# EAGLE design Quad VCA (no pots) CTRL v1 (EAGLE 7.7.0)
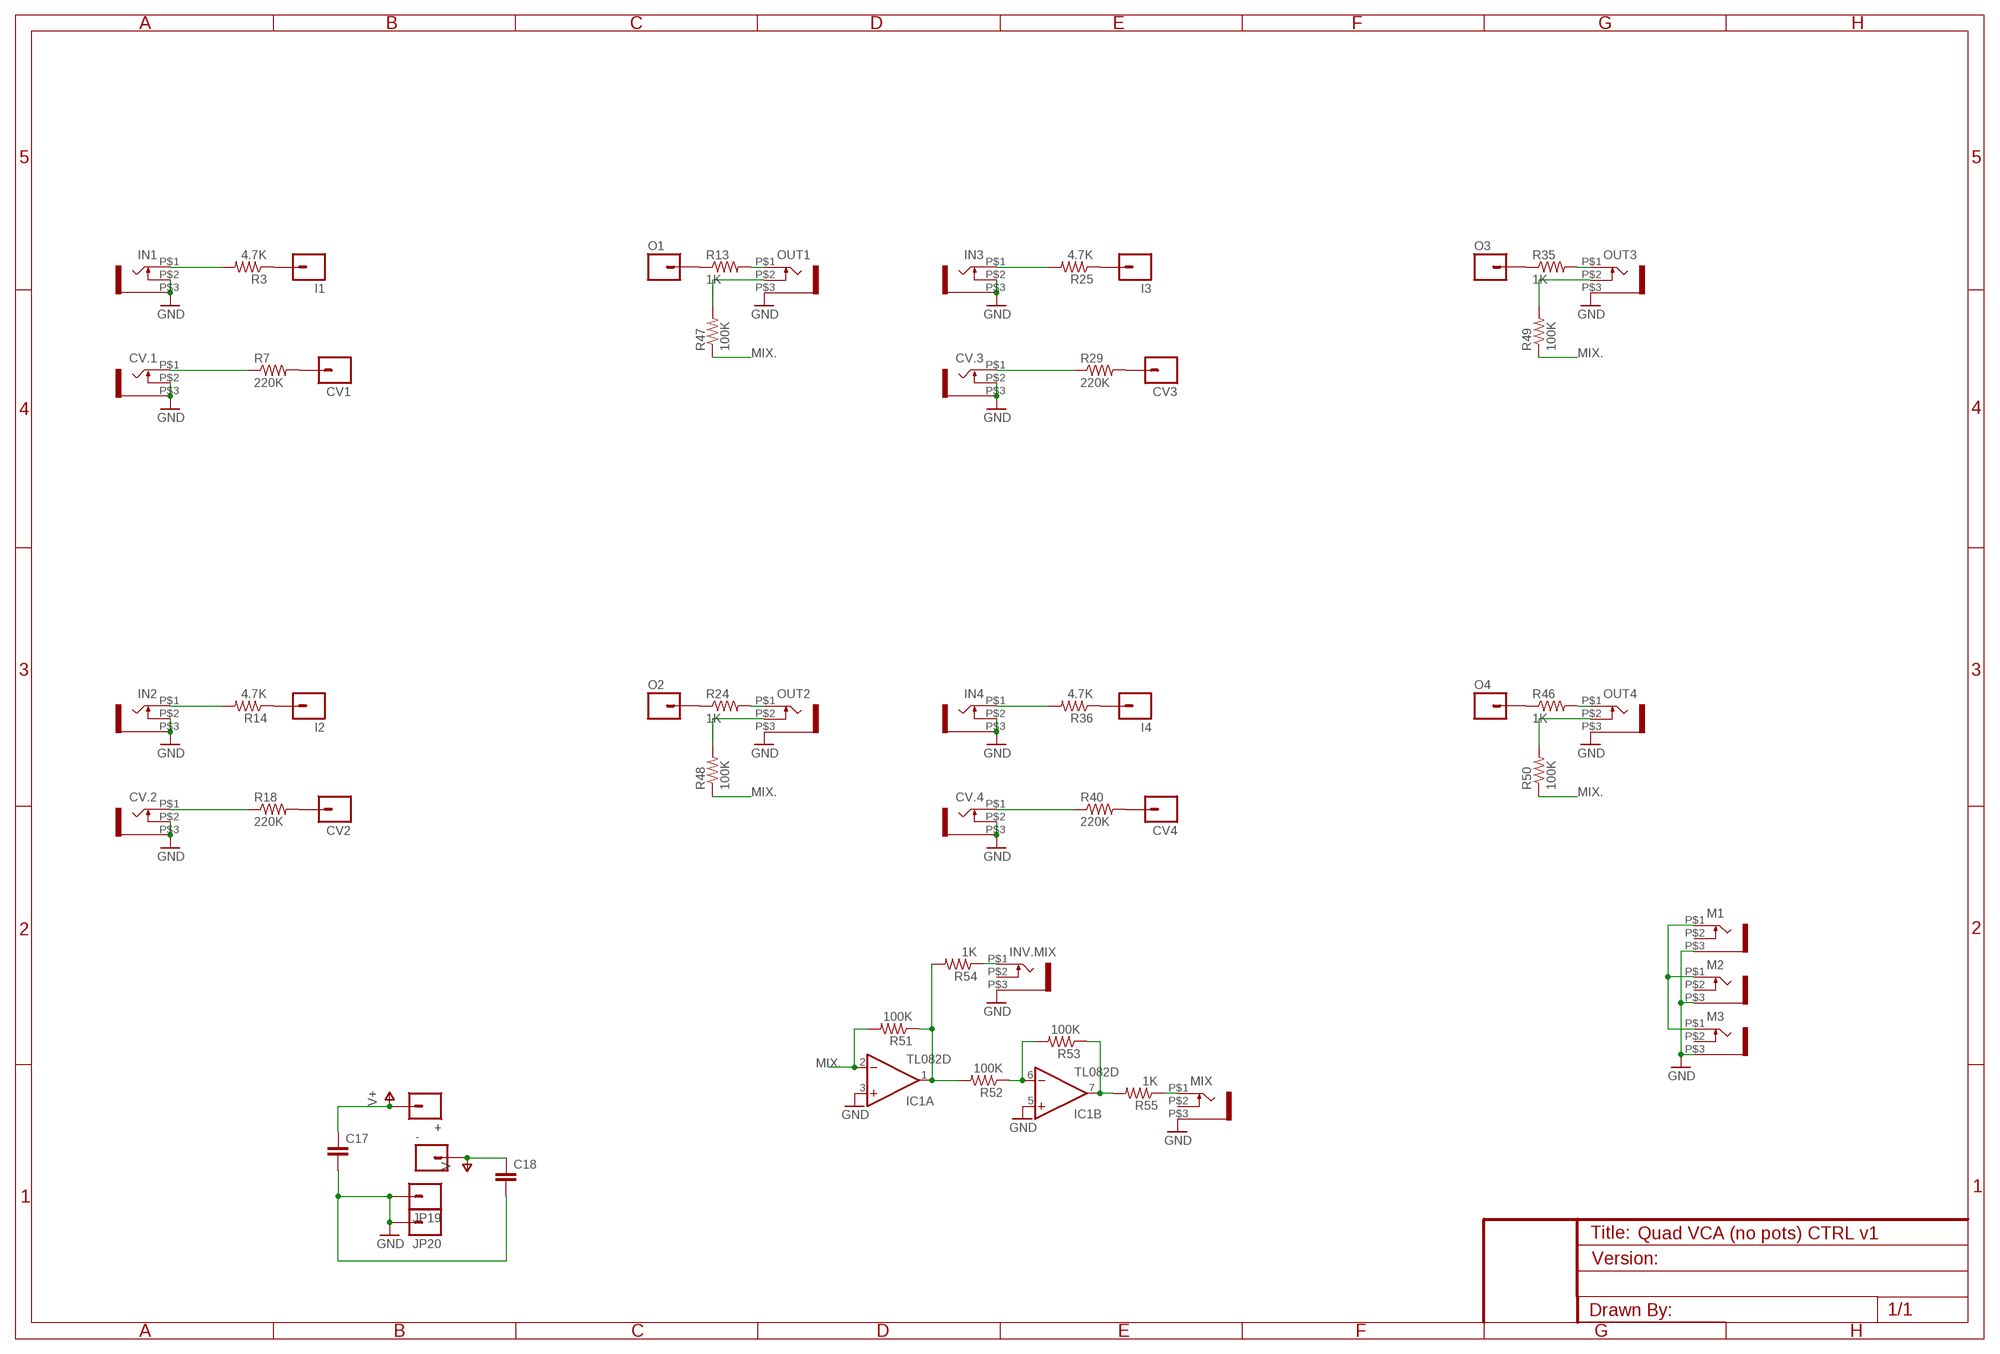
[diagram p0: schematic, sheet 1]

## Parts
+  M01PTH  [1X01]
-  M01PTH  [1X01]
C17  CAP0805  [0805]
C18  CAP0805  [0805]
CV1  M01PTH  [1X01]
CV2  M01PTH  [1X01]
CV3  M01PTH  [1X01]
CV4  M01PTH  [1X01]
CV.1  WQP-PJ301M-12_JACK  [WQP-PJ301M-12_JACK]
CV.2  WQP-PJ301M-12_JACK  [WQP-PJ301M-12_JACK]
CV.3  WQP-PJ301M-12_JACK  [WQP-PJ301M-12_JACK]
CV.4  WQP-PJ301M-12_JACK  [WQP-PJ301M-12_JACK]
I1  M01PTH  [1X01]
I2  M01PTH  [1X01]
I3  M01PTH  [1X01]
I4  M01PTH  [1X01]
IC1  TL082D  [SO08]
IN1  WQP-PJ301M-12_JACK  [WQP-PJ301M-12_JACK]
IN2  WQP-PJ301M-12_JACK  [WQP-PJ301M-12_JACK]
IN3  WQP-PJ301M-12_JACK  [WQP-PJ301M-12_JACK]
IN4  WQP-PJ301M-12_JACK  [WQP-PJ301M-12_JACK]
INV.MIX  WQP-PJ301M-12_JACK  [WQP-PJ301M-12_JACK]
JP19  M01PTH  [1X01]
JP20  M01PTH  [1X01]
M1  WQP-PJ301M-12_JACK  [WQP-PJ301M-12_JACK]
M2  WQP-PJ301M-12_JACK  [WQP-PJ301M-12_JACK]
M3  WQP-PJ301M-12_JACK  [WQP-PJ301M-12_JACK]
MIX  WQP-PJ301M-12_JACK  [WQP-PJ301M-12_JACK]
O1  M01PTH  [1X01]
O2  M01PTH  [1X01]
O3  M01PTH  [1X01]
O4  M01PTH  [1X01]
OUT1  WQP-PJ301M-12_JACK  [WQP-PJ301M-12_JACK]
OUT2  WQP-PJ301M-12_JACK  [WQP-PJ301M-12_JACK]
OUT3  WQP-PJ301M-12_JACK  [WQP-PJ301M-12_JACK]
OUT4  WQP-PJ301M-12_JACK  [WQP-PJ301M-12_JACK]
R3  4.7K  RESISTOR0805-RES  [0805]
R7  220K  RESISTOR0805-RES  [0805]
R13  1K  RESISTOR0805-RES  [0805]
R14  4.7K  RESISTOR0805-RES  [0805]
R18  220K  RESISTOR0805-RES  [0805]
R24  1K  RESISTOR0805-RES  [0805]
R25  4.7K  RESISTOR0805-RES  [0805]
R29  220K  RESISTOR0805-RES  [0805]
R35  1K  RESISTOR0805-RES  [0805]
R36  4.7K  RESISTOR0805-RES  [0805]
R40  220K  RESISTOR0805-RES  [0805]
R46  1K  RESISTOR0805-RES  [0805]
R47  100K  RESISTOR0805-RES  [0805]
R48  100K  RESISTOR0805-RES  [0805]
R49  100K  RESISTOR0805-RES  [0805]
R50  100K  RESISTOR0805-RES  [0805]
R51  100K  RESISTOR0805-RES  [0805]
R52  100K  RESISTOR0805-RES  [0805]
R53  100K  RESISTOR0805-RES  [0805]
R54  1K  RESISTOR0805-RES  [0805]
R55  1K  RESISTOR0805-RES  [0805]

## Nets
GND: C17.2 C18.2 CV.1.P$2 CV.1.P$3 CV.2.P$2 CV.2.P$3 CV.3.P$2 CV.3.P$3 CV.4.P$2 CV.4.P$3 IC1.3(A:+IN) IC1.5(B:+IN) IN1.P$2 IN1.P$3 IN2.P$2 IN2.P$3 IN3.P$2 IN3.P$3 IN4.P$2 IN4.P$3 INV.MIX.P$3 JP19.1 JP20.1 M1.P$3 M2.P$3 M3.P$3 MIX.P$3 OUT1.P$3 OUT2.P$3 OUT3.P$3 OUT4.P$3
MIX.: IC1.2(A:-IN) R47.1 R48.1 R49.1 R50.1 R51.2
N$1: M1.P$1 M2.P$1 M3.P$1
N$2: I1.1 R3.1
N$3: IN1.P$1 R3.2
N$4: CV1.1 R7.2
N$5: O1.1 R13.1
N$6: CV.2.P$1 R18.1
N$8: IC1.1(A:OUT) R51.1 R52.2 R54.2
N$9: IC1.6(B:-IN) R52.1 R53.2
N$10: OUT1.P$2 R47.2
N$11: IN2.P$1 R14.2
N$12: I2.1 R14.1
N$13: O2.1 R24.1
N$14: O3.1 R35.1
N$15: O4.1 R46.1
N$16: CV4.1 R40.2
N$17: I4.1 R36.1
N$18: CV3.1 R29.2
N$19: IC1.7(B:OUT) R53.1 R55.2
N$20: CV.1.P$1 R7.1
N$21: I3.1 R25.1
N$22: CV2.1 R18.2
N$23: INV.MIX.P$1 R54.1
N$24: MIX.P$1 R55.1
N$25: OUT2.P$1 R24.2
N$26: IN3.P$1 R25.2
N$35: CV.3.P$1 R29.1
N$46: CV.4.P$1 R40.1
N$51: OUT1.P$1 R13.2
N$53: OUT3.P$1 R35.2
N$54: IN4.P$1 R36.2
N$63: OUT2.P$2 R48.2
N$68: OUT4.P$1 R46.2
N$69: OUT3.P$2 R49.2
N$72: OUT4.P$2 R50.2
V+: +.1 C17.1
V-: -.1 C18.1
Unconnected: INV.MIX.P$2 M1.P$2 M2.P$2 M3.P$2 MIX.P$2

## Power pins joined to a net without a drawn wire
V+: IC1.8(P:V+)
V-: IC1.4(P:V-)

## Library data of the parts
+ - CV1-CV4 I1-I4 JP19 JP20 O1-O4 = SparkFun-Connectors:M01: Header 1 Standard 1-pin 0.1" header. Use with straight break away headers (SKU : PRT-00116), right angle break away headers (PRT-00553), swiss pins (PRT-00743), machine pins (PRT-00117), and female headers (PRT-00115).
C17 C18 = SparkFun-Capacitors:CAP: Capacitor Standard 0603 ceramic capacitor, and 0.1" leaded capacitor.
CV.1-CV.4 IN1-IN4 INV.MIX M1-M3 MIX OUT1-OUT4 = thonkiconn:WQP-PJ301M-12_JACK
IC1 = linear:TL082: OP AMP Data sheet <http://www.ti.com/lit/ds/symlink/tl084a . pdf>; DATA_SHEET: <a href="http://www.ti.com/lit/ds/symlink/tl084a.pdf"> Data sheet </a>
R3 R7 R13 R14 R18 R24 R25 R29 R35 R36 R40 R46-R55 = SparkFun-Resistors:RESISTOR: Resistor Basic schematic elements and footprints for 0603, 1206, and PTH resistors.

## Board
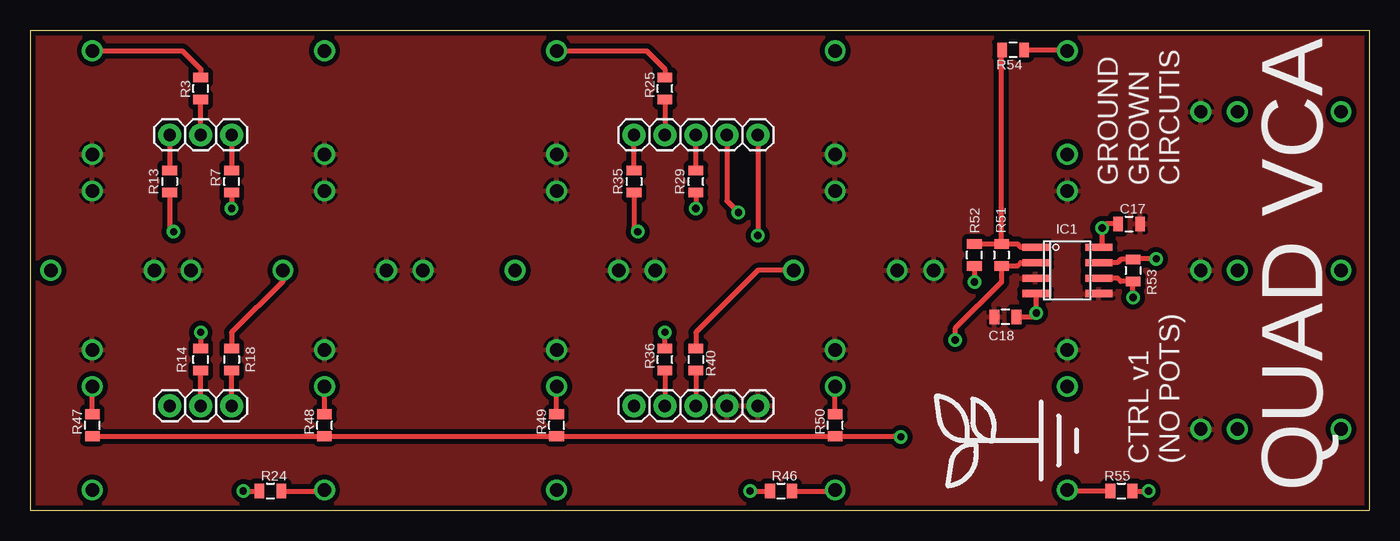
[diagram p1: board, top side]
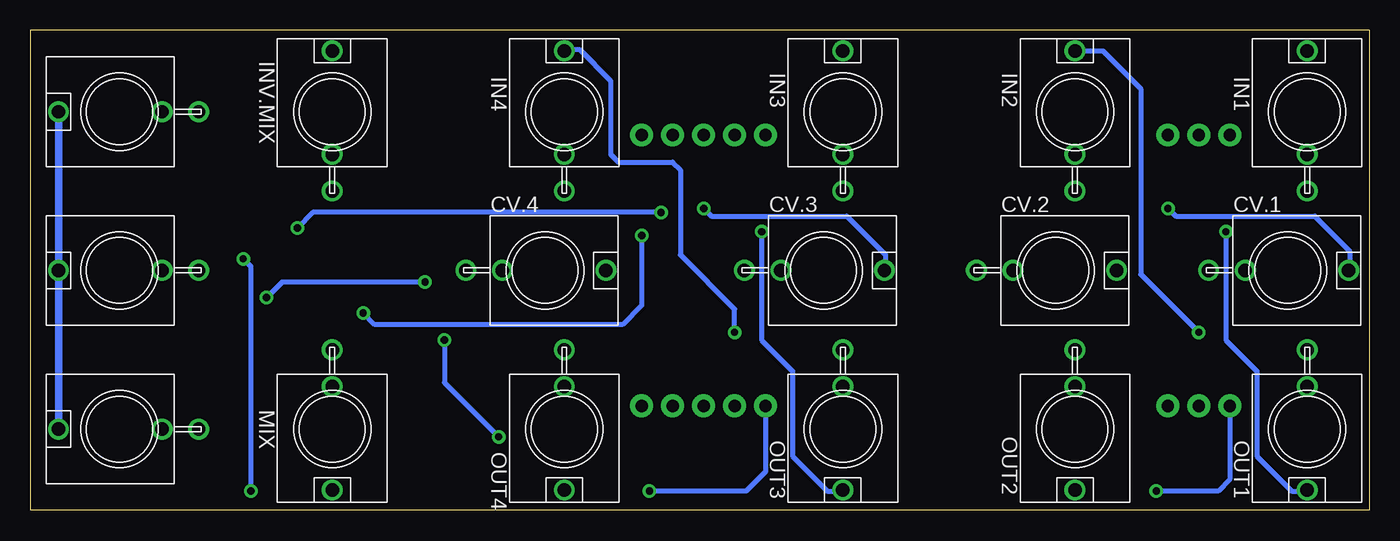
[diagram p2: board, bottom side, seen from below]

Size 109.86 x 39.37 mm. Coordinates in mm from the lower left corner, seen from the top.
Outline: 0,0 109.86,0 109.86,39.37 0,39.37 0,0
Copper layers (1*16): Top 0.035mm / dielectric 1.5mm / Bottom 0.035mm
Design rules "SparkFun": minimum track width 8mil, minimum drill 20mil, track to track 8mil, track to pad 8mil, pad to pad 8mil, via to via 8mil, smd to smd 8mil, copper to edge 8mil, drill to drill 8mil, minimum pad ring 12mil, minimum via ring 10mil, stop-mask expansion 4mil, vias tented up to drill 20mil, thermal gap 10mil

### Footprints (pad centres in the part's own frame; a part is rotated, then mirrored left to right if it is on the bottom)
1X01 = drill 1.016 pad 1.88: 1 0,0
0805 = smd 0.8 x 1.2: 1 -0.9,0; 2 0.9,0
WQP-PJ301M-12_JACK = drill 1.1: P$1 0,5; P$2 0,-3.5; P$3 0,-6.5
SO08 = smd 0.6 x 2.2: 1 -1.905,-2.6; 2 -0.635,-2.6; 3 0.635,-2.6; 4 1.905,-2.6; 5 1.905,2.6; 6 0.635,2.6; 7 -0.635,2.6; 8 -1.905,2.6

### Placement (x,y rotation side)
+  57.15,30.8 0 top
-  59.69,30.8 0 top
C17  90.17,23.5 0 top
C18  80.01,15.88 180 top
CV1  16.51,30.8 0 top
CV2  16.51,8.57 0 top
CV3  54.61,30.8 0 top
CV4  54.61,8.57 0 top
CV.1  6.67,19.68 270 bottom
CV.2  25.72,19.68 270 bottom
CV.3  44.77,19.68 270 bottom
CV.4  67.63,19.68 270 bottom
I1  13.97,30.8 0 top
I2  13.97,8.57 0 top
I3  52.07,30.8 0 top
I4  52.07,8.57 0 top
IC1  85.09,19.68 270 top
IN1  5.08,32.7 0 bottom
IN2  24.13,32.7 0 bottom
IN3  43.18,32.7 0 bottom
IN4  66.04,32.7 0 bottom
INV.MIX  85.09,32.7 0 bottom
JP19  57.15,8.57 0 top
JP20  59.69,8.57 0 top
M1  102.55,32.7 90 bottom
M2  102.55,6.67 90 bottom
M3  102.55,19.68 90 bottom
MIX  85.09,6.67 180 bottom
O1  11.43,30.8 0 top
O2  11.43,8.57 0 top
O3  49.53,30.8 0 top
O4  49.53,8.57 0 top
OUT1  5.08,6.67 180 bottom
OUT2  24.13,6.67 180 bottom
OUT3  43.18,6.67 180 bottom
OUT4  66.04,6.67 180 bottom
R3  13.97,34.61 90 top
R7  16.51,26.99 90 top
R13  11.43,26.99 270 top
R14  13.97,12.38 90 top
R18  16.51,12.38 270 top
R24  19.68,1.59 0 top
R25  52.07,34.61 90 top
R29  54.61,26.99 90 top
R35  49.53,26.99 270 top
R36  52.07,12.38 90 top
R40  54.61,12.38 270 top
R46  61.59,1.59 0 top
R47  5.08,6.99 90 top
R48  24.13,6.99 90 top
R49  43.18,6.99 90 top
R50  66.04,6.99 90 top
R51  79.69,20.95 270 top
R52  77.47,20.95 90 top
R53  90.49,19.68 270 top
R54  80.64,37.78 180 top
R55  89.53,1.59 0 top
U$1  [LOGO_MED]  82.87,5.71 90 top

### Tracks (layer width: path | path; a pad name or v marks a point on that pad's centre or on a via)
GND
  pour Top (isolate 0.406): 0,0 109.86,0 109.86,39.37 0,39.37
MIX.  (via drill 0.6)
  Top 0.406: R47.1 R48.1 R49.1 R50.1 66.09,6.03 v71.44,6.03 | IC1.2 81.28,20.32 81.02,20.05 R51.2 79.69,18.73 75.88,14.92 v75.88,13.97
  Bottom 0.406: v75.88,13.97 75.88,10.48 v71.44,6.03
N$1
  Bottom 0.61: M2.P$1 M3.P$1 M1.P$1
N$2
  Top 0.406: I1.1 R3.1
N$3
  Top 0.406: IN1.P$1 12.46,37.7 13.97,36.2 R3.2
N$4
  Top 0.406: CV1.1 R7.2
N$5
  Top 0.406: O1.1 R13.1
N$6
  Top 0.406: CV.2.P$1 20.72,18.81 16.51,14.61 R18.1
N$8
  Top 0.406: R52.2 R51.1 | R51.1 81.02,21.86 81.28,21.59 IC1.1 | R51.1 79.69,37.73 R54.2
N$9  (via drill 0.6)
  Top 0.406: IC1.6 89.22,19.05 89.48,18.79 R53.2 v90.49,17.46 | R52.1 v77.47,18.73
  Bottom 0.406: v77.47,18.73 89.22,18.73 v90.49,17.46
N$10
  Top 0.406: R47.2 OUT1.P$2
N$11  (via drill 0.6)
  Top 0.406: v13.97,14.61 R14.2
  Bottom 0.406: IN2.P$1 21.83,37.7 18.73,34.61 18.73,19.37 v13.97,14.61
N$12
  Top 0.406: I2.1 R14.1
N$13  (via drill 0.6)
  Top 0.406: v17.46,1.59 R24.1
  Bottom 0.406: O2.1 11.43,2.54 12.38,1.59 v17.46,1.59
N$14
  Top 0.406: R35.1 O3.1
N$15  (via drill 0.6)
  Top 0.406: v59.05,1.59 R46.1
  Bottom 0.406: O4.1 49.53,3.17 51.12,1.59 v59.05,1.59
N$16
  Top 0.406: R40.2 CV4.1
N$17
  Top 0.406: R36.1 I4.1
N$18
  Top 0.406: R29.2 CV3.1
N$19  (via drill 0.6)
  Top 0.406: IC1.7 89.22,20.32 89.48,20.59 R53.1 90.54,20.64 v92.39,20.64 | R55.2 v91.76,1.59
  Bottom 0.406: v91.76,1.59 91.76,20 v92.39,20.64
N$20  (via drill 0.6)
  Top 0.406: R7.1 v16.51,24.77
  Bottom 0.406: v16.51,24.77 15.88,24.13 4.45,24.13 1.59,21.27 1.59,19.77 CV.1.P$1
N$21
  Top 0.406: R25.1 I3.1
N$22
  Top 0.406: CV2.1 R18.2
N$23
  Top 0.406: R54.1 85.01,37.78 INV.MIX.P$1
N$24
  Top 0.406: R55.1 85.17,1.59 MIX.P$1
N$25
  Top 0.406: R24.2 24.05,1.59 OUT2.P$1
N$26
  Top 0.406: IN3.P$1 50.56,37.7 52.07,36.2 R25.2
N$35  (via drill 0.6)
  Top 0.406: R29.1 v54.61,24.77
  Bottom 0.406: v54.61,24.77 53.98,24.13 42.86,24.13 39.69,20.95 39.69,19.77 CV.3.P$1
N$46
  Top 0.406: CV.4.P$1 59.69,19.68 54.61,14.61 R40.1
N$51  (via drill 0.6)
  Top 0.406: R13.2 11.43,23.18 v11.75,22.86
  Bottom 0.406: v11.75,22.86 11.75,13.97 9.21,11.43 9.21,4.45 6.35,1.59 5.16,1.59 OUT1.P$1
N$53  (via drill 0.6)
  Top 0.406: R35.2 49.53,23.18 v49.85,22.86
  Bottom 0.406: v49.85,22.86 49.85,13.97 47.31,11.43 47.31,4.45 44.45,1.59 43.26,1.59 OUT3.P$1
N$54  (via drill 0.6)
  Top 0.406: R36.2 v52.07,14.61
  Bottom 0.406: v52.07,14.61 52.07,16.51 56.52,20.95 56.52,27.94 57.15,28.57 61.59,28.57 62.23,29.21 62.23,35.24 64.77,37.78 65.96,37.78 IN4.P$1
N$63
  Top 0.406: R48.2 OUT2.P$2
N$68
  Top 0.406: R46.2 65.96,1.59 OUT4.P$1
N$69
  Top 0.406: R49.2 OUT3.P$2
N$72
  Top 0.406: R50.2 OUT4.P$2
V+  (via drill 0.6)
  Top 0.406: +.1 57.15,25.4 v58.1,24.45 | IC1.8 87.95,21.85 v87.95,23.18 88.27,23.5 C17.1
  Bottom 0.406: v58.1,24.45 86.68,24.45 v87.95,23.18
V-  (via drill 0.6)
  Top 0.406: -.1 v59.69,22.54 | IC1.4 82.55,17.72 v82.55,16.19 82.23,15.88 C18.1
  Bottom 0.406: v59.69,22.54 59.69,16.83 61.28,15.24 81.6,15.24 v82.55,16.19

### Text on the board
tPlace: GROUND / GROWN / CIRCUTIS | CTRL v1 / (NO POTS) | QUAD VCA